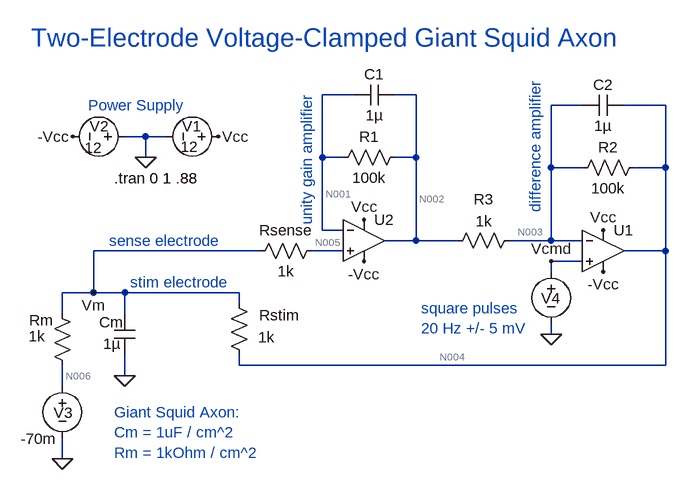
[diagram p0: schematic VC-single-electrode.asc]
VC-single-electrode.asc, the LTspice schematic file:
Version 4
SHEET 1 1784 776
WIRE 464 -192 416 -192
WIRE 560 -192 528 -192
WIRE 816 -176 768 -176
WIRE 944 -176 880 -176
WIRE 144 -128 112 -128
WIRE 176 -128 144 -128
WIRE 144 -96 144 -128
WIRE 416 -96 416 -192
WIRE 448 -96 416 -96
WIRE 560 -96 560 -192
WIRE 560 -96 528 -96
WIRE 768 -80 768 -176
WIRE 816 -80 768 -80
WIRE 944 -80 944 -176
WIRE 944 -80 896 -80
WIRE 416 16 416 -96
WIRE 448 16 416 16
WIRE 560 32 560 -96
WIRE 560 32 512 32
WIRE 624 32 560 32
WIRE 768 32 768 -80
WIRE 768 32 704 32
WIRE 816 32 768 32
WIRE 320 48 64 48
WIRE 448 48 400 48
WIRE 944 48 944 -80
WIRE 944 48 880 48
WIRE 816 64 768 64
WIRE 768 80 768 64
WIRE 64 112 64 48
WIRE 64 112 16 112
WIRE 112 112 64 112
WIRE 288 112 112 112
WIRE 288 128 288 112
WIRE 16 144 16 112
WIRE 112 144 112 112
WIRE 768 176 768 160
WIRE 288 224 288 208
WIRE 944 224 944 48
WIRE 944 224 288 224
WIRE 112 240 112 208
WIRE 16 256 16 224
WIRE 16 368 16 336
FLAG 256 -128 Vcc
FLAG 32 -128 -Vcc
FLAG 768 176 0
FLAG 112 240 0
FLAG 144 -96 0
FLAG 16 368 0
FLAG 848 16 Vcc
FLAG 848 80 -Vcc
FLAG 480 0 Vcc
FLAG 480 64 -Vcc
FLAG 64 112 Vm
FLAG 768 64 Vcmd
SYMBOL voltage 272 -128 R90
WINDOW 0 -16 42 VRight 2
WINDOW 3 16 47 VRight 2
WINDOW 123 0 0 Left 0
WINDOW 39 0 0 Left 0
SYMATTR InstName V1
SYMATTR Value 12
SYMBOL voltage 128 -128 R90
WINDOW 0 -16 41 VRight 2
WINDOW 3 17 51 VRight 2
WINDOW 123 0 0 Left 0
WINDOW 39 0 0 Left 0
SYMATTR InstName V2
SYMATTR Value 12
SYMBOL voltage 768 64 R0
WINDOW 123 0 0 Left 0
WINDOW 39 0 0 Left 0
WINDOW 0 -15 57 Left 2
WINDOW 3 52 140 Invisible 2
SYMATTR InstName V4
SYMATTR Value PULSE(-75m -65m 0 1f 1f .025 .05 999)
SYMBOL cap 96 144 R0
WINDOW 0 -23 14 Left 2
WINDOW 3 -17 47 Left 2
SYMATTR InstName Cm
SYMATTR Value 1µ
SYMBOL res 0 128 R0
WINDOW 0 -35 27 Left 2
WINDOW 3 -36 51 Left 2
SYMATTR InstName Rm
SYMATTR Value 1k
SYMBOL voltage 16 240 R0
WINDOW 123 0 0 Left 0
WINDOW 39 0 0 Left 0
WINDOW 0 -13 57 Left 2
WINDOW 3 -64 97 Left 2
SYMATTR InstName V3
SYMATTR Value -70m
SYMBOL OpAmps\\UniversalOpamp2 848 48 R0
SYMATTR InstName U1
SYMBOL OpAmps\\UniversalOpamp2 480 32 R0
SYMATTR InstName U2
SYMBOL res 544 -112 R90
WINDOW 0 0 56 VBottom 2
WINDOW 3 32 56 VTop 2
SYMATTR InstName R1
SYMATTR Value 100k
SYMBOL cap 528 -208 R90
WINDOW 0 0 32 VBottom 2
WINDOW 3 32 32 VTop 2
SYMATTR InstName C1
SYMATTR Value 1µ
SYMBOL res 912 -96 R90
WINDOW 0 0 56 VBottom 2
WINDOW 3 32 56 VTop 2
SYMATTR InstName R2
SYMATTR Value 100k
SYMBOL cap 880 -192 R90
WINDOW 0 0 32 VBottom 2
WINDOW 3 32 32 VTop 2
SYMATTR InstName C2
SYMATTR Value 1µ
SYMBOL res 720 16 R90
WINDOW 0 -32 56 VBottom 2
WINDOW 3 -29 55 VTop 2
SYMATTR InstName R3
SYMATTR Value 1k
SYMBOL res 416 32 R90
WINDOW 0 0 56 VBottom 2
WINDOW 3 32 56 VTop 2
SYMATTR InstName Rsense
SYMATTR Value 1k
SYMBOL res 304 224 R180
WINDOW 0 -76 77 Left 2
WINDOW 3 -39 43 Left 2
SYMATTR InstName Rstim
SYMATTR Value 1k
TEXT 568 136 Left 2 ;square pulses\n20 Hz +/- 5 mV
TEXT 96 296 Left 2 ;Giant Squid Axon:\nCm = 1uF / cm^2\nRm = 1kOhm / cm^2
TEXT 56 -176 Left 2 ;Power Supply
TEXT -32 -280 Left 4 ;Two-Electrode Voltage-Clamped Giant Squid Axon
TEXT 96 -64 Left 2 !.tran 0 1 .88
TEXT 88 32 Left 2 ;sense electrode
TEXT 392 8 VLeft 2 ;unity gain amplifier
TEXT 744 -216 VRight 2 ;difference amplifier
TEXT 120 96 Left 2 ;stim electrode

The netlist it stands for:
* VC-single-electrode.asc
V1 Vcc 0 12
V2 0 -Vcc 12
V4 Vcmd 0 PULSE(-75m -65m 0 1f 1f .025 .05 999)
Cm Vm 0 1µ
Rm Vm N006 1k
V3 N006 0 -70m
XU1 Vcmd N003 Vcc -Vcc N004 level.2 Avol=1Meg GBW=10Meg Slew=10Meg ilimit=25m rail=0 Vos=0 phimargin=45 en=0 enk=0 in=0 ink=0 Rin=500Meg  ; pins IN+ IN- V+ V- OUT
XU2 N005 N001 Vcc -Vcc N002 level.2 Avol=1Meg GBW=10Meg Slew=10Meg ilimit=25m rail=0 Vos=0 phimargin=45 en=0 enk=0 in=0 ink=0 Rin=500Meg  ; pins IN+ IN- V+ V- OUT
R1 N002 N001 100k
C1 N002 N001 1µ
R2 N004 N003 100k
C2 N004 N003 1µ
R3 N003 N002 1k
Rsense N005 Vm 1k
Rstim N004 Vm 1k
* square pulses
* 20 Hz +/- 5 mV
* Giant Squid Axon:
* Cm = 1uF / cm^2
* Rm = 1kOhm / cm^2
* Power Supply
* Two-Electrode Voltage-Clamped Giant Squid Axon
.tran 0 1 .88
* sense electrode
* unity gain amplifier
* difference amplifier
* stim electrode
.lib UniversalOpamps2.sub
.backanno
.end

* Results of the author's LTspice run, read from the files saved beside the schematic
* Operating Point, zero values left out:
*   V(vcc) = 12 V
*   V(-vcc) = -12 V
*   V(vcmd) = -75 mV
*   V(vm) = -74.94 mV
*   V(n006) = -70 mV
*   V(n004) = -79.87 mV
*   V(n003) = -75 mV
*   V(n002) = -74.95 mV
*   V(n001) = -74.94 mV
*   V(n005) = -74.94 mV
*   I(Rstim) = -4.937 µA
*   I(Rsense) = 149.9 pA
*   I(R3) = -48.58 nA
*   I(R2) = -48.73 nA
*   I(R1) = -149.9 pA
*   I(Rm) = -4.937 µA
*   I(V3) = -4.937 µA
*   I(V4) = 150 pA
*   I(V2) = -2.401 mA
*   I(V1) = -2.396 mA
*   Ix(u1:1) = -150 pA
*   Ix(u1:2) = -150 pA
*   Ix(u1:3) = 1.197 mA
*   Ix(u1:4) = -1.202 mA
*   Ix(u1:5) = 4.985 µA
*   Ix(u2:1) = -149.9 pA
*   Ix(u2:2) = -149.9 pA
*   Ix(u2:3) = 1.199 mA
*   Ix(u2:4) = -1.199 mA
*   Ix(u2:5) = -48.43 nA
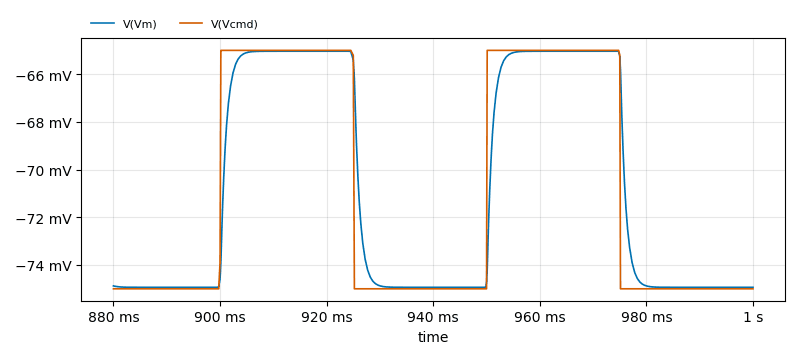
[diagram p1: Transient Analysis of VC-single-electrode.asc, plotted from the saved traces]
* Transient Analysis, 1 run:
*   V(Vm): min -74.94 mV, max -65.04 mV, average -70.81 mV, rms 70.96 mV, last -74.94 mV
*   V(Vcmd): min -75 mV, max -65 mV, average -70.83 mV, rms 71 mV, last -75 mV